# Altium schematic sheet MOSFET_Driver_Sheet4.SchDoc
size 420 x 297 mm; SheetNumber: 30; SheetTotal: 32
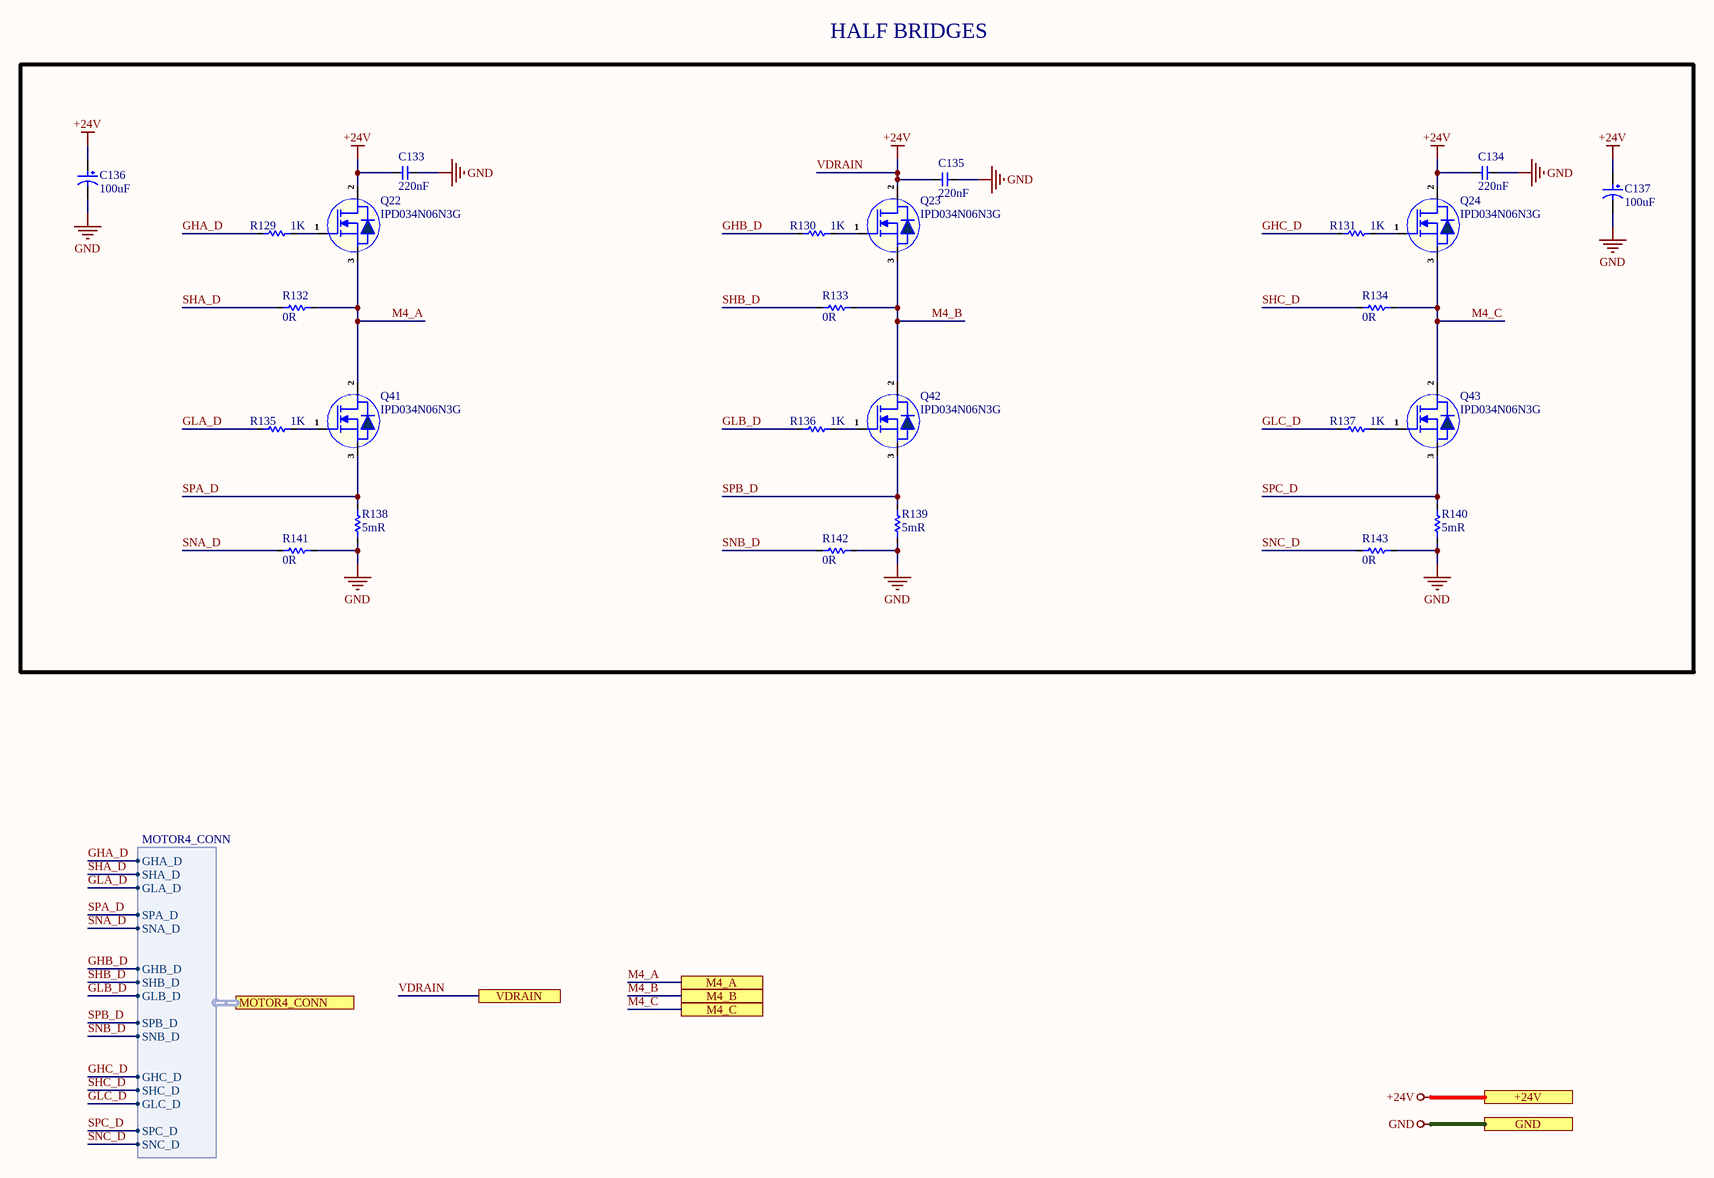
[diagram p0: MOSFET_Driver_Sheet4.SchDoc]

## Parts
C133  220nF  [Cap-0805]
C134  220nF  [Cap-0805]
C135  220nF  [Cap-0805]
C136  100uF  [RVT1A101M0605]
C137  100uF  [RVT1A101M0605]
Q22  IPD034N06N3G  [TO-252-2L]
Q23  IPD034N06N3G  [TO-252-2L]
Q24  IPD034N06N3G  [TO-252-2L]
Q41  IPD034N06N3G  [TO-252-2L]
Q42  IPD034N06N3G  [TO-252-2L]
Q43  IPD034N06N3G  [TO-252-2L]
R129  1K  [Res-0402]
R130  1K  [Res-0402]
R131  1K  [Res-0402]
R132  0R  [Res-0603]
R133  0R  [Res-0603]
R134  0R  [Res-0603]
R135  1K  [Res-0402]
R136  1K  [Res-0402]
R137  1K  [Res-0402]
R138  5mR  [Res-1206]
R139  5mR  [Res-1206]
R140  5mR  [Res-1206]
R141  0R  [Res-0603]
R142  0R  [Res-0603]
R143  0R  [Res-0603]

## Ports
+24V (see Servo4[4A], Connector_Sheet[5D], DIO_1[5D], DIO_2[5D], DIO_3[5D], DIO_4[5D], MOSFET_Driver_Sheet1[5D], MOSFET_Driver_Sheet2[5D], MOSFET_Driver_Sheet3[5D], Motor_Driver_Sheet1[5D], Motor_Driver_Sheet2[5D], Motor_Driver_Sheet3[5D], Motor_Driver_Sheet4[5D], Power_Sheet[5D]), GND (see Servo4[4B], CAN_Sheet[5D], Connector_Sheet[5D], Controller_Sheet[5D], DIO_1[5D], DIO_2[5D], DIO_3[5D], DIO_4[5D], Encoder_Sheet1[5D], Encoder_Sheet2[5D], Encoder_Sheet3[5D], Encoder_Sheet4[5D], EtherCAT_Sheet[5D], MOSFET_Driver_Sheet1[5D], MOSFET_Driver_Sheet2[5D], MOSFET_Driver_Sheet3[5D], Motor_Driver_Sheet1[5D], Motor_Driver_Sheet2[5D], Motor_Driver_Sheet3[5D], Motor_Driver_Sheet4[5D], Power_Sheet[5D], RJ45_Sheet[5D], RS485_RS232_Sheet[3D], Sec_Controller_Sheet1[5D], Sec_Controller_Sheet2[5D], Sec_Controller_Sheet3[5D], Sec_Controller_Sheet4[5D]), M4_A (see Servo4[5B], Connector_Sheet[4D], Servo4[5B]), M4_B (see Servo4[5B], Connector_Sheet[4D], Servo4[5B]), M4_C (see Servo4[5B], Connector_Sheet[4D], Servo4[5B]), MOTOR4_CONN (harness MOTOR4_CONN, see Servo4[4B], Motor_Driver_Sheet4[2D]), VDRAIN (see Servo4[4B], MOSFET_Driver_Sheet1[2D], MOSFET_Driver_Sheet2[2D], MOSFET_Driver_Sheet3[2D], Motor_Driver_Sheet1[2D], Motor_Driver_Sheet2[2D], Motor_Driver_Sheet3[2D], Motor_Driver_Sheet4[2D])

## Harnesses
MOTOR4_CONN: GHA_D, SHA_D, GLA_D, SPA_D, SNA_D, GHB_D, SHB_D, GLB_D, SPB_D, SNB_D, GHC_D, SHC_D, GLC_D, SPC_D, SNC_D

## Nets
GND: C133.1 C134.1 C135.1 C136.2 C137.2 R138.1 R139.1 R140.1 R141.1 R142.1 R143.1 ; port GND
VDRAIN: C133.2 C134.2 C135.2 C136.1 C137.1 Q22.2(D) Q23.2(D) Q24.2(D) ; port +24V, port VDRAIN  [also labelled +24V]
GHA_D: R129.1 ; port MOTOR4_CONN.GHA_D
GHB_D: R130.1 ; port MOTOR4_CONN.GHB_D
GHC_D: R131.1 ; port MOTOR4_CONN.GHC_D
GLA_D: R135.1 ; port MOTOR4_CONN.GLA_D
GLB_D: R136.1 ; port MOTOR4_CONN.GLB_D
GLC_D: R137.1 ; port MOTOR4_CONN.GLC_D
M4_A: Q22.3(S) Q41.2(D) R132.1 ; port M4_A
M4_B: Q23.3(S) Q42.2(D) R133.1 ; port M4_B
M4_C: Q24.3(S) Q43.2(D) R134.1 ; port M4_C
SHA_D: R132.2 ; port MOTOR4_CONN.SHA_D
SHB_D: R133.2 ; port MOTOR4_CONN.SHB_D
SHC_D: R134.2 ; port MOTOR4_CONN.SHC_D
SNA_D: R141.2 ; port MOTOR4_CONN.SNA_D
SNB_D: R142.2 ; port MOTOR4_CONN.SNB_D
SNC_D: R143.2 ; port MOTOR4_CONN.SNC_D
SPA_D: Q41.3(S) R138.2 ; port MOTOR4_CONN.SPA_D
SPB_D: Q42.3(S) R139.2 ; port MOTOR4_CONN.SPB_D
SPC_D: Q43.3(S) R140.2 ; port MOTOR4_CONN.SPC_D
NetQ22_1: Q22.1(G) R129.2
NetQ23_1: Q23.1(G) R130.2
NetQ24_1: Q24.1(G) R131.2
NetQ41_1: Q41.1(G) R135.2
NetQ42_1: Q42.1(G) R136.2
NetQ43_1: Q43.1(G) R137.2

## Notes on the sheet
- HALF BRIDGES
- File:
- Title:
- Date:
- Page
- Num:
- Total:
- Drawn By: Huzaifa Ali

## Library data of the parts
C133-C135 = 08051C224K4T2A: CAP CER 0.22UF 100V X7R 0805; Manufacturer: Kyocera AVX; Tolerance: 10%; Item Type: Capacitor; Supplier 1: Digi-Key; Manufacturer Part Number: 08051C224K4T2A; RoHS: Yes; Category: Ceramic Capacitors; Stock 1: 151; Pricing 1: 1=0.27000, 10=0.18500, 50=0.12320, 100=0.10470, 500=0.07392, 1000=0.06468 (USD); Mount: Surface Mount; Case/Package: 0805; Contact Plating: Tin; Min Operating Temperature: -55°C; Max Operating Temperature: 125°C; Termination: Wraparound; Capacitance: 220nF; Dielectric: X7R; Voltage Rating (DC): 100V; Length: 2.01mm; RoHS Compliant: Yes; ComponentLink1URL: http://datasheets.avx.com/AutoMLCC.pdf?src-supplier=Avnet+Asia; ComponentLink1Description: http://datasheets.avx.com/AutoMLCC.pdf?src-supplier=Avnet+Asia; Supplier Part Number 1: 478-13049-1-ND; LCSC Part Number: C2176107
C136 C137 = RVT1A101M0605: 100uF 10V 55mA@120Hz ±20% SMD,D6.3xL5.4mm Aluminum Electrolytic Capacitors - SMD ROHS; Manufacturer: ROQANG; Manufacturer Part Number: RVT1A101M0605; Package: SMD,D6.3xL5.4mm; LCSC Part Number: C72474; Item Type: Capacitor; ComponentLink1Description: LCSC; ComponentLink1URL: https://www.lcsc.com/product-detail/Aluminum-Electrolytic-Capacitors-SMD_ROQANG-RVT1A101M0605_C72474.html
Q22-Q24 Q41-Q43 = IPD034N06N3G: MOSFET N-CH 60V 100A TO252-3; Manufacturer: Infineon; Supplier: Mouser; Supplier Part Number: 726-IPD034N06N3G; Manufacturer Part Number: IPD034N06N3G; RoHS: Yes; Stock: 7587; Pricing: 1=1.76, 10=1.48, 50=1.48, 100=1.2, 1000=0.837, 10000=0.747 (USD); LCSC Part Number: C94897; Item Type: Mosfet
R129-R131 R135-R137 = RC0402FR-071KL: RES 1K OHM 1% 1/16W 0402; Manufacturer: Yageo; Resistance: 1kR; Temperature Coefficient: 100ppm/°C; Voltage Rating (DC): 50V; Power Rating: 62.5mW; Max Power Dissipation: 63mW; Item Type: Resistor; Supplier 1: Avnet; Manufacturer Part Number: RC0402FR-071KL; RoHS: Yes; Category: Chip SMD Resistors; Stock 1: 13030000; Pricing 1: 10000=0.00085, 20000=0.00087, 40000=0.00084, 60000=0.00083, 80000=0.00079, 100000=0.00078, 1000000=0.00076 (USD); Case/Package: 0402; Number of Pins: 2; Case Code (Imperial): 0402; Case Code (Metric): 1005; Size Code: 0402; Min Operating Temperature: -55°C; Max Operating Temperature: 155°C; Resistor Type: Thick Film; Tolerance: 1%; Packaging: Tape and Reel; Voltage Rating: 50V; Termination: SMD/SMT; Features: Moisture Resistant; Series: RC; Number of Terminations: 2; Resistance Tolerance: 1%; Construction: Rectangular; Technology: THICK FILM; Length: 1mm; Width: 0.5mm; Height: 0.32mm; Depth: 0.5mm; Reach SVHC Compliant: Yes; Lead Free: Lead Free; RoHS Compliant: Yes; Military Standard: Not; ComponentLink1URL: https://datasheet.ciiva.com/11819/0900766b80c66297-11819477.pdf?src-supplier=RSComponents; ComponentLink1Description: https://datasheet.ciiva.com/11819/0900766b80c66297-11819477.pdf?src-supplier=RSComponents; ComponentLink2URL: https://datasheet.ciiva.com/7983/1018594-7983502.pdf?src-supplier=Element14; ComponentLink2Description: https://datasheet.ciiva.com/7983/1018594-7983502.pdf?src-supplier=Element14; ComponentLink3URL: https://datasheet.ciiva.com/22747/1018594-22747513.pdf?src-supplier=Element14; ComponentLink3Description: https://datasheet.ciiva.com/22747/1018594-22747513.pdf?src-supplier=Element14; ComponentLink4URL: https://datasheet.ciiva.com/12666/pyu-rc0402-51-rohs-l-6-r-12666741.pdf?src-supplier=Mouser; ComponentLink4Description: https://datasheet.ciiva.com/12666/pyu-rc0402-51-rohs-l-6-r-12666741.pdf?src-supplier=Mouser; ComponentLink5URL: https://datasheet.ciiva.com/7849/1018594-7849869.pdf?src-supplier=Element14; ComponentLink5Description: https://datasheet.ciiva.com/7849/1018594-7849869.pdf?src-supplier=Element14; ComponentLink6URL: https://datasheet.ciiva.com/7849/1018594-7849871.pdf?src-supplier=Element14; ComponentLink6Description: https://datasheet.ciiva.com/7849/1018594-7849871.pdf?src-supplier=Element14; ComponentLink7URL: https://datasheet.ciiva.com/17063/pyu-rc0402-51-rohs-l-6-r-17063193.pdf?src-supplier=Future+Electronics; ComponentLink7Description: https://datasheet.ciiva.com/17063/pyu-rc0402-51-rohs-l-6-r-17063193.pdf?src-supplier=Future+Electronics; Supplier Part Number 1: RC0402FR-071KL; LCSC Part Number: C106235
R132-R134 R141-R143 = RC0603JR-070RL: RES 0 OHM JUMPER 1/10W 0603; Manufacturer: Yageo; Resistance: 0mR; Tolerance: 1%; Power Rating: 100mW; Voltage Rating (DC): 50V; Temperature Coefficient: 200ppm/°C; Resistance Tolerance: 5%; Item Type: Resistor; Supplier 1: Digi-Key; Manufacturer Part Number: RC0603JR-070RL; RoHS: Yes; Category: Chip SMD Resistors; Stock 1: 18081776; Pricing 1: 1=0.10000, 10=0.01700, 25=0.01240, 50=0.00960, 100=0.00700, 250=0.00536, 500=0.00430, 1000=0.00316 (USD); Case/Package: 0603; Number of Pins: 2; Contact Plating: Tin,Matte; Case Code (Imperial): 0603; Case Code (Metric): 1608; Size Code: 0603; Min Operating Temperature: -55°C; Max Operating Temperature: 155°C; Resistor Type: Thick Film; Packaging: Tape and Reel; Termination: SMD/SMT; Series: RC; Technology: THICK FILM; Package Quantity: 5000; Voltage Rating: 50V; Features: Moisture Resistant; Max Power Dissipation: 100mW; Number of Terminations: 2; Construction: Rectangular; Length: 1.6mm; Width: 0.8mm; Height: 0.45mm; Depth: 0.8mm; Radiation Hardening: No; Reach SVHC Compliant: No SVHC; Lead Free: Lead Free; RoHS Compliant: Yes; Military Standard: Not; Supplier Part Number 1: 311-0.0GRCT-ND; LCSC Part Number: C95177
R138-R140 = CUM1206-15FR005: 1W 5mΩ ±1% 1206 Current Sense Resistors/Shunt Resistors ROHS; Manufacturer: FORT; Item Type: Capacitor; Manufacturer Part Number: CUM1206-15FR005; Package: 1206; LCSC Part Number: C5185588; ComponentLink1Description: LCSC; ComponentLink1URL: https://www.lcsc.com/product-detail/Current-Sense-Resistors-Shunt-Resistors_FORT-CUM1206-15FR005_C5185588.html